# EAGLE design KarateLight-exp (EAGLE 6.3)

## Sheet 1 of 2
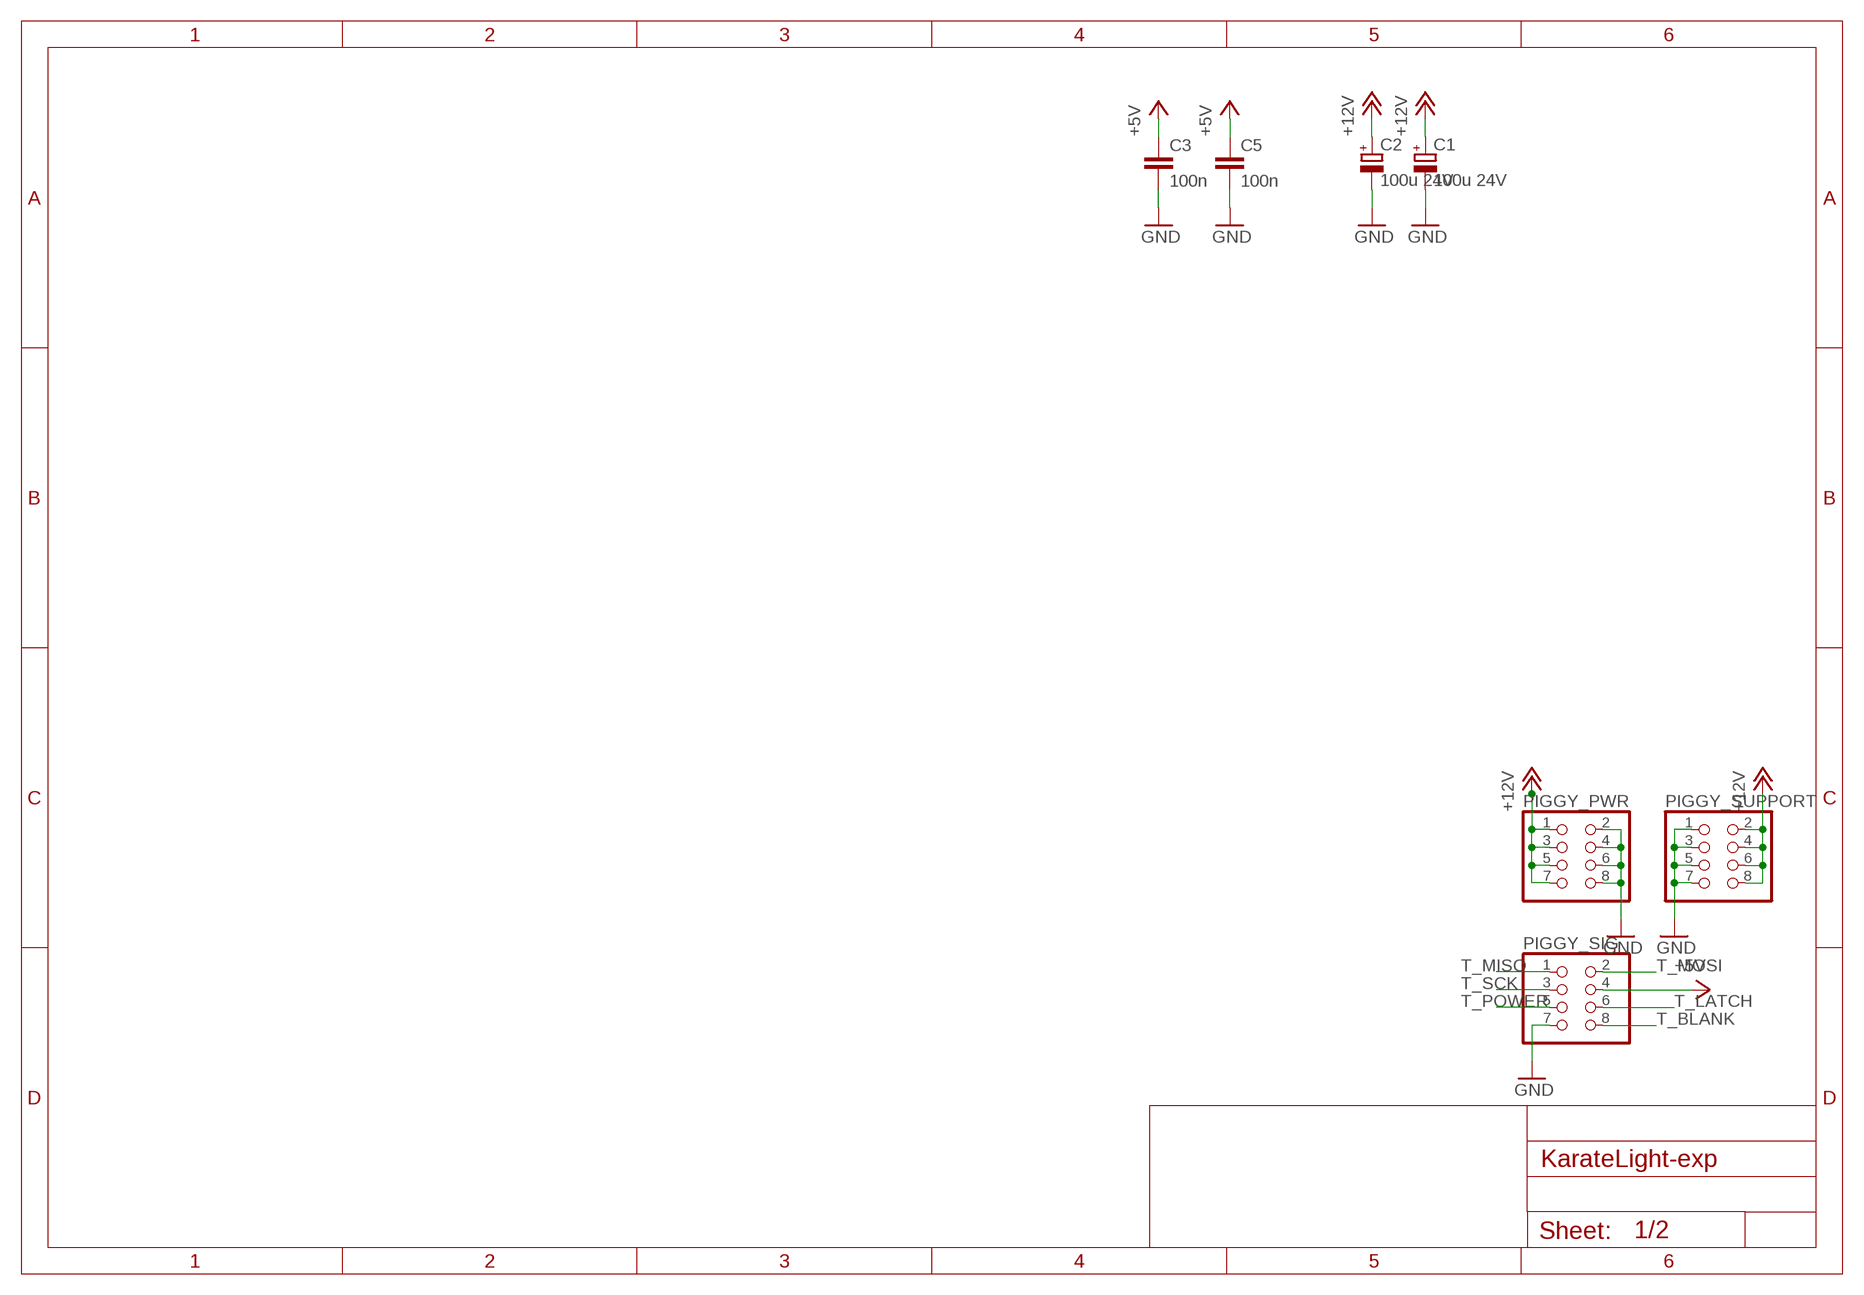
[diagram p0: schematic, sheet 1]

### Parts
C1  100u 24V  CPOL-EU153CLV-0605  [153CLV-0605]
C2  100u 24V  CPOL-EU153CLV-0605  [153CLV-0605]
C3  100n  C-EUC0603  [C0603]
C5  100n  C-EUC0603  [C0603]
PIGGY_PWR  PINHD-2X4  [2X04]
PIGGY_SIG  PINHD-2X4  [2X04]
PIGGY_SUPPORT  PINHD-2X4  [2X04]

### Nets
+5V: C3.1 C5.1 PIGGY_SIG.4 ; also sheet 2
+12V: C1.+ C2.+ PIGGY_PWR.1 PIGGY_PWR.3 PIGGY_PWR.5 PIGGY_PWR.7 PIGGY_SUPPORT.2 PIGGY_SUPPORT.4 PIGGY_SUPPORT.6 PIGGY_SUPPORT.8 ; also sheet 2
GND: C1.- C2.- C3.2 C5.2 PIGGY_PWR.2 PIGGY_PWR.4 PIGGY_PWR.6 PIGGY_PWR.8 PIGGY_SIG.7 PIGGY_SUPPORT.1 PIGGY_SUPPORT.3 PIGGY_SUPPORT.5 PIGGY_SUPPORT.7 ; also sheet 2
T_BLANK: PIGGY_SIG.8 ; also sheet 2
T_LATCH: PIGGY_SIG.6 ; also sheet 2
T_MISO: PIGGY_SIG.1 ; also sheet 2
T_MOSI: PIGGY_SIG.2 ; also sheet 2
T_POWER: PIGGY_SIG.5 ; also sheet 2
T_SCK: PIGGY_SIG.3 ; also sheet 2

## Sheet 2 of 2
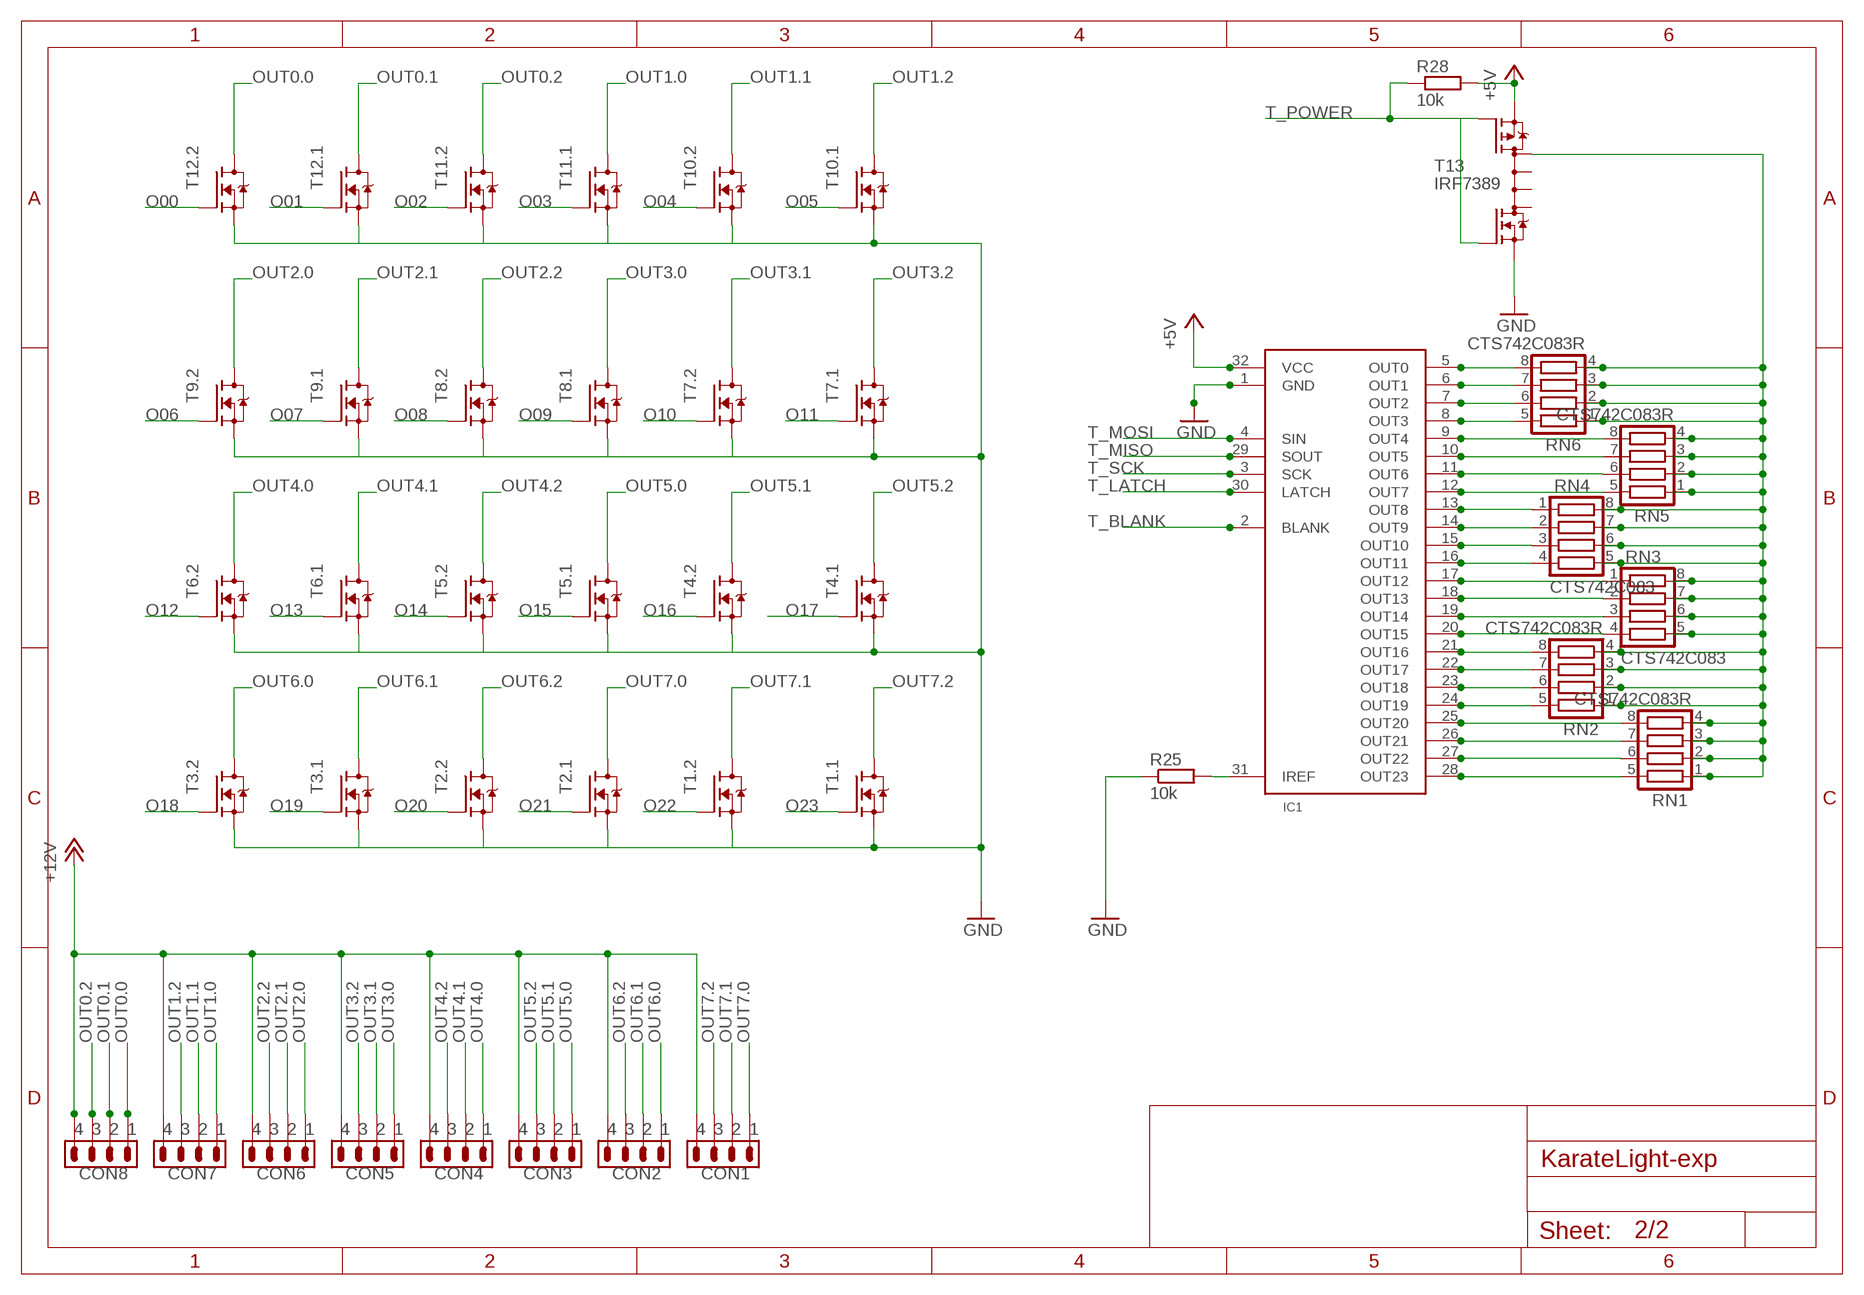
[diagram p1: schematic, sheet 2]

### Parts
CON1  PINHEAD_4W  [MA04-1]
CON2  PINHEAD_4W  [MA04-1]
CON3  PINHEAD_4W  [MA04-1]
CON4  PINHEAD_4W  [MA04-1]
CON5  PINHEAD_4W  [MA04-1]
CON6  PINHEAD_4W  [MA04-1]
CON7  PINHEAD_4W  [MA04-1]
CON8  PINHEAD_4W  [MA04-1]
IC1  TLC5947  [TSSOP32]
R25  10k  R-EU_R0603  [R0603]
R28  10k  R-EU_R0603  [R0603]
RN1  CTS742C083R  [CTS742C083]
RN2  CTS742C083R  [CTS742C083]
RN3  CTS742C083  [CTS742C083]
RN4  CTS742C083  [CTS742C083]
RN5  CTS742C083R  [CTS742C083]
RN6  CTS742C083R  [CTS742C083]
T1  IRF7103  [SO08-IRF]
T2  IRF7103  [SO08-IRF]
T3  IRF7103  [SO08-IRF]
T4  IRF7103  [SO08-IRF]
T5  IRF7103  [SO08-IRF]
T6  IRF7103  [SO08-IRF]
T7  IRF7103  [SO08-IRF]
T8  IRF7103  [SO08-IRF]
T9  IRF7103  [SO08-IRF]
T10  IRF7103  [SO08-IRF]
T11  IRF7103  [SO08-IRF]
T12  IRF7103  [SO08-IRF]
T13  IRF7389  [SO08-IRF]

### Nets
+5V: IC1.32(VCC) R28.2 T13.3(P-S) ; also sheet 1
+12V: CON1.4 CON2.4 CON3.4 CON4.4 CON5.4 CON6.4 CON7.4 CON8.4 ; also sheet 1
FET-ONOFF: RN1.1 RN1.2 RN1.3 RN1.4 RN2.1 RN2.2 RN2.3 RN2.4 RN3.5 RN3.6 RN3.7 RN3.8 RN4.5 RN4.6 RN4.7 RN4.8 RN5.1 RN5.2 RN5.3 RN5.4 RN6.1 RN6.2 RN6.3 RN6.4 T13.5(D)
GND: IC1.1(GND) R25.1 T1.1(.1:S) T1.3(.2:S) T2.1(.1:S) T2.3(.2:S) T3.1(.1:S) T3.3(.2:S) T4.1(.1:S) T4.3(.2:S) T5.1(.1:S) T5.3(.2:S) T6.1(.1:S) T6.3(.2:S) T7.1(.1:S) T7.3(.2:S) T8.1(.1:S) T8.3(.2:S) T9.1(.1:S) T9.3(.2:S) T10.1(.1:S) T10.3(.2:S) T11.1(.1:S) T11.3(.2:S) T12.1(.1:S) T12.3(.2:S) T13.1(N-S) ; also sheet 1
N$1: IC1.31(IREF) R25.2
O00: IC1.5(OUT0) RN6.8 T12.4(.2:G)
O01: IC1.6(OUT1) RN6.7 T12.2(.1:G)
O02: IC1.7(OUT2) RN6.6 T11.4(.2:G)
O03: IC1.8(OUT3) RN6.5 T11.2(.1:G)
O04: IC1.9(OUT4) RN5.8 T10.4(.2:G)
O05: IC1.10(OUT5) RN5.7 T10.2(.1:G)
O06: IC1.11(OUT6) RN5.6 T9.4(.2:G)
O07: IC1.12(OUT7) RN5.5 T9.2(.1:G)
O08: IC1.13(OUT8) RN4.1 T8.4(.2:G)
O09: IC1.14(OUT9) RN4.2 T8.2(.1:G)
O10: IC1.15(OUT10) RN4.3 T7.4(.2:G)
O11: IC1.16(OUT11) RN4.4 T7.2(.1:G)
O12: IC1.17(OUT12) RN3.1 T6.4(.2:G)
O13: IC1.18(OUT13) RN3.2 T6.2(.1:G)
O14: IC1.19(OUT14) RN3.3 T5.4(.2:G)
O15: IC1.20(OUT15) RN3.4 T5.2(.1:G)
O16: IC1.21(OUT16) RN2.8 T4.4(.2:G)
O17: IC1.22(OUT17) RN2.7 T4.2(.1:G)
O18: IC1.23(OUT18) RN2.6 T3.4(.2:G)
O19: IC1.24(OUT19) RN2.5 T3.2(.1:G)
O20: IC1.25(OUT20) RN1.8 T2.4(.2:G)
O21: IC1.26(OUT21) RN1.7 T2.2(.1:G)
O22: IC1.27(OUT22) RN1.6 T1.4(.2:G)
O23: IC1.28(OUT23) RN1.5 T1.2(.1:G)
OUT0.0: CON8.1 T12.6(.2:D)
OUT0.1: CON8.2 T12.8(.1:D)
OUT0.2: CON8.3 T11.6(.2:D)
OUT1.0: CON7.1 T11.8(.1:D)
OUT1.1: CON7.2 T10.6(.2:D)
OUT1.2: CON7.3 T10.8(.1:D)
OUT2.0: CON6.1 T9.6(.2:D)
OUT2.1: CON6.2 T9.8(.1:D)
OUT2.2: CON6.3 T8.6(.2:D)
OUT3.0: CON5.1 T8.8(.1:D)
OUT3.1: CON5.2 T7.6(.2:D)
OUT3.2: CON5.3 T7.8(.1:D)
OUT4.0: CON4.1 T6.6(.2:D)
OUT4.1: CON4.2 T6.8(.1:D)
OUT4.2: CON4.3 T5.6(.2:D)
OUT5.0: CON3.1 T5.8(.1:D)
OUT5.1: CON3.2 T4.6(.2:D)
OUT5.2: CON3.3 T4.8(.1:D)
OUT6.0: CON2.1 T3.6(.2:D)
OUT6.1: CON2.2 T3.8(.1:D)
OUT6.2: CON2.3 T2.6(.2:D)
OUT7.0: CON1.1 T2.8(.1:D)
OUT7.1: CON1.2 T1.6(.2:D)
OUT7.2: CON1.3 T1.8(.1:D)
T_BLANK: IC1.2(BLANK) ; also sheet 1
T_LATCH: IC1.30(LATCH) ; also sheet 1
T_MISO: IC1.29(SOUT) ; also sheet 1
T_MOSI: IC1.4(SIN) ; also sheet 1
T_POWER: R28.1 T13.2(N-G) T13.4(P-G) ; also sheet 1
T_SCK: IC1.3(SCK) ; also sheet 1
Unconnected: T13.6(D) T13.7(D) T13.8(D)

## Library data of the parts
C1 C2 = rcl:CPOL-EU: POLARIZED CAPACITOR, European symbol
C3 C5 = rcl:C-EU: CAPACITOR, European symbol
CON1-CON8 = pinheader:PINHEAD_4W
IC1 = TLC5947:TLC5947: 24CH PWM LED Driver
PIGGY_PWR PIGGY_SIG PIGGY_SUPPORT = pinhead:PINHD-2X4: PIN HEADER
R25 R28 = rcl:R-EU_: RESISTOR, European symbol
RN1 RN2 RN5 RN6 = res-network:CTS742C083: Chip Resistor Array 4 Single Resistor Source: http://www.ctscorp.com/components/Datasheets/CTSChipArrayDs.pdf
RN3 RN4 = res-network:CTS742C083: Chip Resistor Array 4 Single Resistor Source: http://www.ctscorp.com/components/Datasheets/CTSChipArrayDs.pdf; OC_FARNELL: unknown; OC_NEWARK: unknown
T1-T12 = IRF7103:IRF7103: Dual HexFET Power Mosfet http://www.irf.com/product-info/datasheets/data/irf7103.pdf
T13 = transistor-fet:IRF7389: Complimentary Half Bridge HEXFET Power MOSFET Source: http://www.irf.com/product-info/datasheets/data/irf7389.pdf

## Board
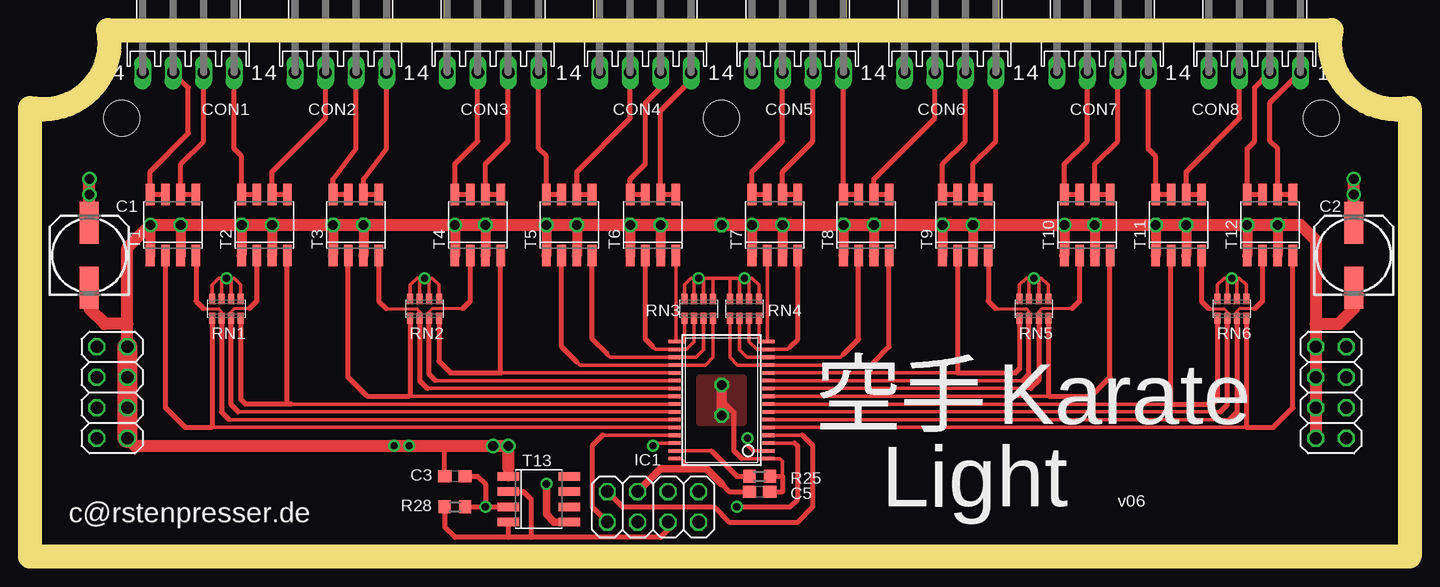
[diagram p2: board, top side]
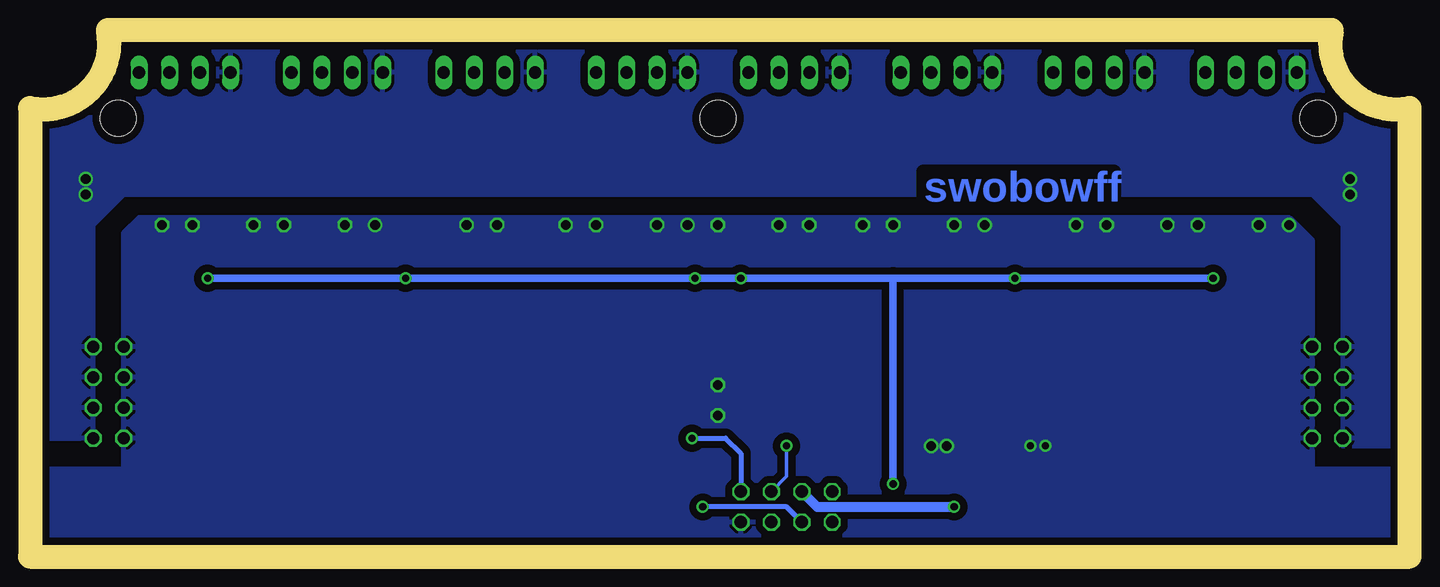
[diagram p3: board, bottom side, seen from below]

Size 115 x 43.89 mm. Coordinates in mm from the lower left corner, seen from the top.
Outline: 115,37.39 arc-113 108.5,43.89 6.5,43.89 arc-113 0,37.39 0,0 115,0 115,37.39
Copper layers (1*16): Top 0.035mm / dielectric 1.5mm / Bottom 0.035mm
Design rules "haka_35_l2": minimum track width 0.15mm, minimum drill 0.3mm, track to track 0.15mm, track to pad 0.15mm, pad to pad 0.15mm, via to via 0.15mm, smd to smd 0mil, copper to edge 0.2mm, drill to drill 0.2mm, minimum pad ring 0.2mm, minimum via ring 0.2mm, stop-mask expansion 0.1mm, vias tented up to drill 0mil, thermal gap 10mil
Holes 3 mm at 57.65,36.55 7.65,36.55 107.65,36.55

### Footprints (pad centres in the part's own frame; a part is rotated, then mirrored left to right if it is on the bottom)
153CLV-0605 = smd 3.5 x 1.6: + 2.7,0; - -2.7,0
C0603 = smd 1.1 x 1: 1 -0.85,0; 2 0.85,0
MA04-1 = drill 1.016 long: 1 -3.81,0; 2 -1.27,0; 3 1.27,0; 4 3.81,0
TSSOP32 = smd 0.305 x 0.991: 1 -4.875,-3.918; 2 -4.225,-3.918; 3 -3.575,-3.918; 4 -2.925,-3.918; 5 -2.275,-3.918; 6 -1.625,-3.918; 7 -0.975,-3.918; 8 -0.325,-3.918; 9 0.325,-3.918; 10 0.975,-3.918; 11 1.625,-3.918; 12 2.275,-3.918; 13 2.925,-3.918; 14 3.575,-3.918; 15 4.225,-3.918; 16 4.875,-3.918; 17 4.875,3.918; 18 4.225,3.918; 19 3.575,3.918; 20 2.925,3.918; 21 2.275,3.918; 22 1.625,3.918; 23 0.975,3.918; 24 0.325,3.918; 25 -0.325,3.918; 26 -0.975,3.918; 27 -1.625,3.918; 28 -2.275,3.918; 29 -2.925,3.918; 30 -3.575,3.918; 31 -4.225,3.918; 32 -4.875,3.918
2X04 = drill 1.016 octagon: 1 -3.81,-1.27; 2 -3.81,1.27; 3 -1.27,-1.27; 4 -1.27,1.27; 5 1.27,-1.27; 6 1.27,1.27; 7 3.81,-1.27; 8 3.81,1.27
R0603 = smd 1 x 1.1: 1 -0.85,0; 2 0.85,0
CTS742C083 = smd 0.5 x 0.9: 1 -1.2,-0.8; 2 -0.4,-0.8; 3 0.4,-0.8; 4 1.2,-0.8; 5 1.2,0.8; 6 0.4,0.8; 7 -0.4,0.8; 8 -1.2,0.8
SO08-IRF = smd 0.72 x 1.78: 1 -1.905,-2.543; 2 -0.635,-2.543; 3 0.635,-2.543; 4 1.905,-2.543; 5 1.905,2.543; 6 0.635,2.543; 7 -0.635,2.543; 8 -1.905,2.543

### Placement (x,y rotation side)
C1  4.95,25.11 90 top
C2  110.36,25.11 90 top
C3  35.42,6.7 180 top
C5  60.82,5.43 0 top
CON1  13.2,40.35 180 top
CON2  25.9,40.35 180 top
CON3  38.6,40.35 180 top
CON4  51.3,40.35 180 top
CON5  64,40.35 180 top
CON6  76.7,40.35 180 top
CON7  89.4,40.35 180 top
CON8  102.1,40.35 180 top
IC1  57.65,13.05 90 top
PIGGY_PWR  6.85,13.68 270 top
PIGGY_SIG  51.93,4.16 0 top
PIGGY_SUPPORT  108.45,13.68 270 top
R25  60.82,6.7 180 top
R28  35.42,4.16 0 top
RN1  16.38,20.67 180 top
RN2  32.88,20.67 180 top
RN3  55.74,20.67 0 top
RN4  59.55,20.67 0 top
RN5  83.69,20.67 180 top
RN6  100.2,20.67 180 top
T1  11.93,27.66 0 top
T2  19.55,27.66 0 top
T3  27.17,27.66 0 top
T4  37.33,27.66 0 top
T5  44.95,27.66 0 top
T6  51.93,27.66 0 top
T7  62.09,27.66 0 top
T8  69.72,27.66 0 top
T9  77.97,27.66 0 top
T10  88.13,27.66 0 top
T11  95.75,27.66 0 top
T12  103.37,27.66 0 top
T13  42.41,4.79 270 top

### Tracks (layer width: path | path; a pad name or v marks a point on that pad's centre or on a via)
+5V  (via drill 0.6 pad 0.61)
  Top 0.305: IC1.32 54.27,8.18 55.11,7.33
  Top 0.406: R28.2 v37.96,4.16 | v37.96,4.16 T13.3 | 57.65,6.07 58.28,5.43 C5.1 | C3.1 37.33,6.7 37.96,6.07 v37.96,4.16
  Top 0.61: 57.65,6.07 56.38,7.33 55.11,7.33 52.57,7.33 PIGGY_SIG.4
  Bottom 0.813: PIGGY_SIG.4 49.39,4.16 v37.96,4.16
+12V  (via drill 0.8)
  Top 1.016: C1.+ v4.95,30.2 v4.95,31.46 | v110.36,31.46 v110.36,30.2 C2.+
  pour Bottom (isolate 0.61): 1.14,9.24 1.14,42.89 114.17,42.89 114.17,9.88 109.72,9.88 109.72,27.66 107.18,30.2 8.12,30.2 5.58,27.66 5.58,9.24
FET-ONOFF  (via drill 0.6 pad 0.25)
  Top 0.305: RN1.4 15.17,22.64 15.74,23.21 15.97,23.21 | 16.78,23.21 17.01,23.21 17.58,22.64 RN1.1 | RN1.2 16.78,23.21 | 16.78,23.21 v16.38,23.21 15.97,23.21 | RN1.3 15.97,23.21 | RN2.4 31.69,22.64 32.25,23.21 32.48,23.21 | 32.48,23.21 v32.88,23.21 33.28,23.21 | RN2.1 34.09,22.64 33.52,23.21 33.28,23.21 | RN3.8 54.54,22.64 55.11,23.21 55.34,23.21 | RN4.5 60.75,22.64 60.19,23.21 59.95,23.21 | 59.95,23.21 v59.55,23.21 59.16,23.21 | 59.16,23.21 58.35,23.21 | 58.35,23.21 56.95,23.21 | 56.95,23.21 56.14,23.21 | RN5.4 82.48,22.64 83.05,23.21 83.29,23.21 | RN5.1 84.89,22.64 84.32,23.21 84.09,23.21 | RN6.4 99,22.64 99.56,23.21 99.8,23.21 | RN6.1 101.4,22.64 100.83,23.21 100.59,23.21 | RN6.2 100.59,23.21 | 100.59,23.21 v100.2,23.21 99.8,23.21 | RN6.3 99.8,23.21 | RN5.2 84.09,23.21 | RN5.3 83.29,23.21 | 83.29,23.21 v83.69,23.21 84.09,23.21 | RN4.8 58.35,23.21 | RN4.7 59.16,23.21 | RN4.6 59.95,23.21 | RN3.7 55.34,23.21 | RN3.6 56.14,23.21 | 56.14,23.21 v55.74,23.21 55.34,23.21 | RN3.5 56.95,23.21 | RN2.2 33.28,23.21 | RN2.3 32.48,23.21
  Top 0.61: T13.5 43.68,2.89 43.04,3.52 v43.04,6.07
  Bottom 0.61: v100.2,23.21 v83.69,23.21 v59.55,23.21 v55.74,23.21 43.04,23.21 | 43.04,23.21 v32.88,23.21 v16.38,23.21 | v43.04,6.07 43.04,23.21
GND  (via drill 0.6 pad 0.41, 0.8, 0.8 pad 0.61, 0.8 pad 0.81)
  Top 0.305: 62.73,6.7 62.73,7.97 62.52,8.18 IC1.1 59.35,8.18
  Top 0.406: 57.65,13.05 58.65,12.05 58.65,8.88 59.35,8.18 | v39.87,9.24 39.87,7.97 | 39.86,7.33 39.87,7.34 | C5.2 62.73,5.43 62.73,6.7 R25.1 | C3.2 34.57,8.82 34.16,9.24
  Top 0.813: v104.01,27.66 T12.3 | v50.03,27.66 T6.1 | v52.57,27.66 T6.3 | v67.81,27.66 T8.1 | v70.35,27.66 T8.3 | v60.19,27.66 T7.1 | v62.73,27.66 T7.3 | v76.07,27.66 T9.1 | v78.61,27.66 T9.3 | v101.47,27.66 T12.1 | v96.39,27.66 T11.3 | v93.84,27.66 T11.1 | v88.77,27.66 T10.3 | v86.23,27.66 T10.1 | v10.03,27.66 T1.1 | v12.56,27.66 T1.3 | v17.65,27.66 T2.1 | v20.19,27.66 T2.3 | v25.27,27.66 T3.1 | v27.81,27.66 T3.3 | v35.42,27.66 T4.1 | v37.96,27.66 T4.3 | v43.04,27.66 T5.1 | v45.59,27.66 T5.3 | v57.65,11.78 v57.65,14.32 57.65,13.05 | PIGGY_PWR.8 8.76,9.24 | 39.87,7.34 T13.1
  Top 1.016: PIGGY_PWR.2 8.12,19.4 | 8.12,19.4 8.12,25.75 v10.03,27.66 v12.56,27.66 v17.65,27.66 v20.19,27.66 v25.27,27.66 v27.81,27.66 v35.42,27.66 v37.96,27.66 v43.04,27.66 v45.59,27.66 v50.03,27.66 v52.57,27.66 v57.65,27.66 v60.19,27.66 v62.73,27.66 v67.81,27.66 v70.35,27.66 v76.07,27.66 v78.61,27.66 v86.23,27.66 v88.77,27.66 v93.84,27.66 v96.39,27.66 v101.47,27.66 v104.01,27.66 105.91,27.66 107.18,26.38 107.18,19.4 | 8.76,9.24 v30.35,9.24 v31.62,9.24 34.16,9.24 v38.6,9.24 v39.87,9.24 39.87,7.34 | 107.18,19.4 PIGGY_SUPPORT.7 | C1.- 4.95,20.67 6.21,19.4 8.12,19.4 | C2.- 110.36,20.67 109.09,19.4 107.18,19.4
  Top 1.676: PIGGY_PWR.8 PIGGY_PWR.6 PIGGY_PWR.4 PIGGY_PWR.2
  pour Top: 59.55,11.14 59.55,14.96 55.74,14.96 55.74,11.14
  pour Bottom (isolate 0.61): 0.86,0.08 114.58,0.08 114.8,7.33 107.18,7.33 107.18,27.02 105.91,28.29 10.03,28.29 8.12,26.38 8.12,7.33 0.5,7.33
N$1
  Top 0.305: IC1.31 56.79,8.82
  Top 0.406: 56.79,8.82 58.92,6.7 R25.2
N$8
  Top 0.406: 17.65,30.2 18.92,30.2
N$11
  Top 0.406: 20.19,30.2 21.46,30.2
N$12
  Top 0.406: 25.27,30.2 26.54,30.2
N$13
  Top 0.406: 27.81,30.2 29.08,30.2
N$15
  Top 0.406: 35.42,30.2 36.7,30.2
N$16
  Top 0.406: 37.96,30.2 39.23,30.2
N$17
  Top 0.406: 43.04,30.2 44.31,30.2
N$19
  Top 0.406: 45.59,30.2 46.85,30.2
N$20
  Top 0.406: 50.03,30.2 51.3,30.2
N$21
  Top 0.406: 52.57,30.2 53.84,30.2
N$22
  Top 0.406: 60.19,30.2 61.46,30.2
N$23
  Top 0.406: 62.73,30.2 64,30.2
N$24
  Top 0.406: 67.81,30.2 69.08,30.2
N$25
  Top 0.406: 70.35,30.2 71.62,30.2
N$26
  Top 0.406: 76.07,30.2 77.34,30.2
N$27
  Top 0.406: 78.61,30.2 79.88,30.2
N$28
  Top 0.406: 86.23,30.2 87.5,30.2
N$29
  Top 0.406: 88.77,30.2 90.04,30.2
N$30
  Top 0.406: 93.84,30.2 95.12,30.2
N$31
  Top 0.406: 96.39,30.2 97.66,30.2
N$32
  Top 0.406: 101.47,30.2 102.73,30.2
N$35
  Top 0.406: 10.03,30.2 11.29,30.2
O00
  Top 0.305: IC1.5 101.47,10.77 101.4,10.84
  Top 0.406: T12.4 105.28,12.41 103.64,10.77 101.47,10.77 | RN6.8 101.4,10.84
O01
  Top 0.254: 102.1,20.67 100.83,20.67 100.59,20.43 RN6.7
  Top 0.305: IC1.6 99.96,11.42
  Top 0.406: RN6.7 100.59,12.06 99.96,11.42 | T12.2 102.73,21.3 102.1,20.67
O02
  Top 0.254: 98.29,20.67 99.56,20.67 99.8,20.43 RN6.6
  Top 0.305: IC1.7 99.22,12.07
  Top 0.406: 99.22,12.07 99.8,12.65 RN6.6 | T11.4 97.66,21.3 98.29,20.67
O03
  Top 0.305: IC1.8 95.12,12.72
  Top 0.406: T11.2 95.12,12.72 98.6,12.72 99,13.12 RN6.5
O04
  Top 0.305: IC1.9 84.95,13.38 84.89,13.45 | 88.45,13.38 89.08,14
  Top 0.406: 88.77,13.68 89.08,14 90.04,14.96 T10.4 | 84.95,13.38 88.45,13.38 | RN5.8 84.89,13.45
O05
  Top 0.254: 86.86,20.67 84.32,20.67 84.09,20.43 RN5.7
  Top 0.305: IC1.10 83.45,14.02
  Top 0.406: T10.2 87.5,21.3 86.86,20.67 | RN5.7 84.09,14.66 83.45,14.02
O06
  Top 0.254: 80.51,20.67 83.05,20.67 83.29,20.43 RN5.6
  Top 0.305: IC1.11 82.77,14.67
  Top 0.406: 82.77,14.67 83.29,15.19 RN5.6 | T9.4 79.88,21.3 80.51,20.67
O07
  Top 0.305: IC1.12 77.34,15.32
  Top 0.406: T9.2 77.34,15.32 82.15,15.32 82.48,15.66 RN5.5
O08
  Top 0.305: 70.35,16.23 70.1,15.97 IC1.13 58.99,15.97 58.35,16.61 RN4.1
  Top 0.406: 70.35,16.23 71.62,17.5 T8.4
O09
  Top 0.305: 67.81,16.86 67.58,16.62 IC1.14 59.79,16.62 59.16,17.26 RN4.2
  Top 0.406: 67.81,16.86 69.08,18.13 T8.2
O10
  Top 0.305: 63.36,17.5 63.14,17.27 IC1.15 60.59,17.27 59.95,17.91 RN4.3
  Top 0.406: 63.36,17.5 64,18.13 T7.4
O11
  Top 0.305: T7.2 61.46,18.03 IC1.16 60.75,17.93 RN4.4
  Top 0.406: T7.2
O12
  Top 0.305: T6.4 53.84,17.93 IC1.17 54.54,17.93 RN3.1
  Top 0.406: T6.4
O13
  Top 0.305: 51.93,17.5 52.16,17.27 IC1.18 54.71,17.27 55.34,17.91 RN3.2
  Top 0.406: 51.93,17.5 51.3,18.13 T6.2
O14
  Top 0.305: 48.12,16.86 48.36,16.62 IC1.19 55.51,16.62 56.14,17.26 RN3.3
  Top 0.406: 48.12,16.86 46.85,18.13 T5.4
O15
  Top 0.305: 45.59,16.23 45.84,15.97 IC1.20 56.31,15.97 56.95,16.61 RN3.4
  Top 0.406: 45.59,16.23 44.31,17.5 T5.2
O16
  Top 0.305: 39.23,15.32 IC1.21
  Top 0.406: T4.4 39.23,15.32 35.05,15.32 34.09,16.3 RN2.8
O17
  Top 0.254: 36.06,20.67 33.52,20.67 33.28,20.43 RN2.7
  Top 0.305: 33.8,14.67 IC1.22
  Top 0.406: 33.8,14.67 33.28,15.19 RN2.7 | T4.2 36.7,21.3 36.06,20.67
O18
  Top 0.254: 29.71,20.67 32.25,20.67 32.48,20.43 RN2.6
  Top 0.305: 33.12,14.02 IC1.23
  Top 0.406: RN2.6 32.48,14.66 33.12,14.02 | T3.4 29.08,21.3 29.71,20.67
O19
  Top 0.305: IC1.24 31.62,13.38 31.69,13.45
  Top 0.406: T3.2 26.54,14.96 28.12,13.38 31.62,13.38 | RN2.5 31.69,13.45
O20
  Top 0.305: 21.78,12.72 IC1.25
  Top 0.406: 21.46,12.72 T2.4 | 21.78,12.72 21.46,12.72 | 21.46,12.72 17.97,12.72 17.58,13.12 RN1.8
O21
  Top 0.254: 18.28,20.67 17.01,20.67 16.78,20.43 RN1.7
  Top 0.305: 17.35,12.07 IC1.26
  Top 0.406: 17.35,12.07 16.78,12.65 RN1.7 | T2.2 18.92,21.3 18.28,20.67
O22
  Top 0.254: 14.47,20.67 15.74,20.67 15.97,20.43 RN1.6
  Top 0.305: 16.61,11.42 IC1.27
  Top 0.406: RN1.6 15.97,12.06 16.61,11.42 | T1.4 13.83,21.3 14.47,20.67
O23
  Top 0.254: 15.17,10.84 15.11,10.77
  Top 0.305: 15.11,10.77 IC1.28
  Top 0.406: T1.2 11.29,12.41 12.94,10.77 15.11,10.77 | RN1.5 15.17,10.84
OUT0.0
  Top 0.406: CON8.1 103.37,37.81 103.37,34.64 104.01,34.01 T12.6 105.28,30.2
OUT0.1
  Top 0.406: CON8.2 102.1,39.09 102.1,34.64 101.47,34.01 T12.8
OUT0.2
  Top 0.406: CON8.3 100.83,36.55 96.39,32.1 T11.6
OUT1.0
  Top 0.406: T11.8 93.84,33.37 93.21,34.01 CON7.1
OUT1.1
  Top 0.406: T10.6 88.77,32.73 90.67,34.64 CON7.2
OUT1.2
  Top 0.406: T10.8 86.23,32.73 88.13,34.64 CON7.3
OUT2.0
  Top 0.406: T9.6 78.61,32.73 80.51,34.64 CON6.1
OUT2.1
  Top 0.406: T9.8 76.07,32.73 77.97,34.64 CON6.2
OUT2.2
  Top 0.406: T8.6 70.35,31.46 75.43,36.55 CON6.3
OUT3.0
  Top 0.406: T8.8 CON5.1
OUT3.1
  Top 0.406: T7.6 62.73,32.1 65.27,34.64 CON5.2
OUT3.2
  Top 0.406: T7.8 60.19,32.1 62.73,34.64 CON5.3
OUT4.0
  Top 0.406: T6.6 52.57,37.18 55.11,39.72 CON4.1
OUT4.1
  Top 0.406: T6.8 50.03,31.46 51.3,32.73 51.3,37.81 52.57,39.09 CON4.2
OUT4.2
  Top 0.406: T5.6 45.59,32.1 50.03,36.55 CON4.3
OUT5.0
  Top 0.406: T5.8 43.04,33.37 42.41,34.01 CON3.1
OUT5.1
  Top 0.406: T4.6 37.96,32.73 39.87,34.64 CON3.2
OUT5.2
  Top 0.406: T4.8 35.42,32.73 37.33,34.64 CON3.3
OUT6.0
  Top 0.406: T3.6 27.81,31.46 29.71,34.01 CON2.1
OUT6.1
  Top 0.406: T3.8 25.27,31.46 27.17,34.01 CON2.2
OUT6.2
  Top 0.406: CON2.3 24.63,36.55 20.19,32.1 T2.6
OUT7.0
  Top 0.406: T2.8 17.65,33.37 17.01,34.01 CON1.1
OUT7.1
  Top 0.406: CON1.2 14.47,34.64 12.56,32.73 12.56,30.83 12.57,30.83 T1.6 13.83,30.2
OUT7.2
  Top 0.406: CON1.3 13.2,39.09 13.2,35.27 10.03,32.1 T1.8
T_BLANK  (via drill 0.6)
  Top 0.305: IC1.2 60.22,8.82 59.81,9.24 v59.81,9.88
  Bottom 0.406: PIGGY_SIG.8 55.74,8.61 57.02,9.88 v59.81,9.88
T_LATCH  (via drill 0.6 pad 0.41)
  Top 0.305: v51.93,9.24 52.17,9.47 IC1.30
  Bottom 0.305: PIGGY_SIG.6 51.93,6.7 v51.93,9.24
T_MISO
  Top 0.305: IC1.29 47.74,10.12
  Top 0.406: 47.74,10.12 46.85,9.24 46.85,4.16 PIGGY_SIG.1
T_MOSI
  Top 0.305: IC1.4 64.39,10.12
  Top 0.406: PIGGY_SIG.2 49.39,4.16 57.02,4.16 58.28,2.89 64,2.89 65.27,4.16 65.27,9.24 64.39,10.12
T_POWER
  Top 0.406: PIGGY_SIG.5 53.2,2.25 52.57,1.62 41.77,1.62 | 41.77,1.62 39.87,1.62 | 39.87,1.62 35.42,1.62 34.57,2.47 R28.1 | T13.4 39.87,1.62 | T13.2 41.14,5.43 41.77,4.79 41.77,1.62
T_SCK  (via drill 0.6 pad 0.41)
  Top 0.305: IC1.3 63.77,9.47
  Top 0.406: v58.92,4.16 63.36,4.16 64,4.79 64,9.24 63.77,9.47
  Bottom 0.406: PIGGY_SIG.3 51.93,4.16 v58.92,4.16

### Text on the board
Bottom: swobowff
tNames: Karate | Light | v06 | c@rstenpresser.de